# EasyEDA schematic SCH_steren_mot-300_water_pump_conmutation_circuit_2024-02-13.json

## Sheets
1 template_circuit: TITLE: Steren MOT-300 3v3 switching circuit; REV: 1.0; Date: 2024-02-13; Sheet: 1/1; Drawn By: Mortrack8; Company: Your Company
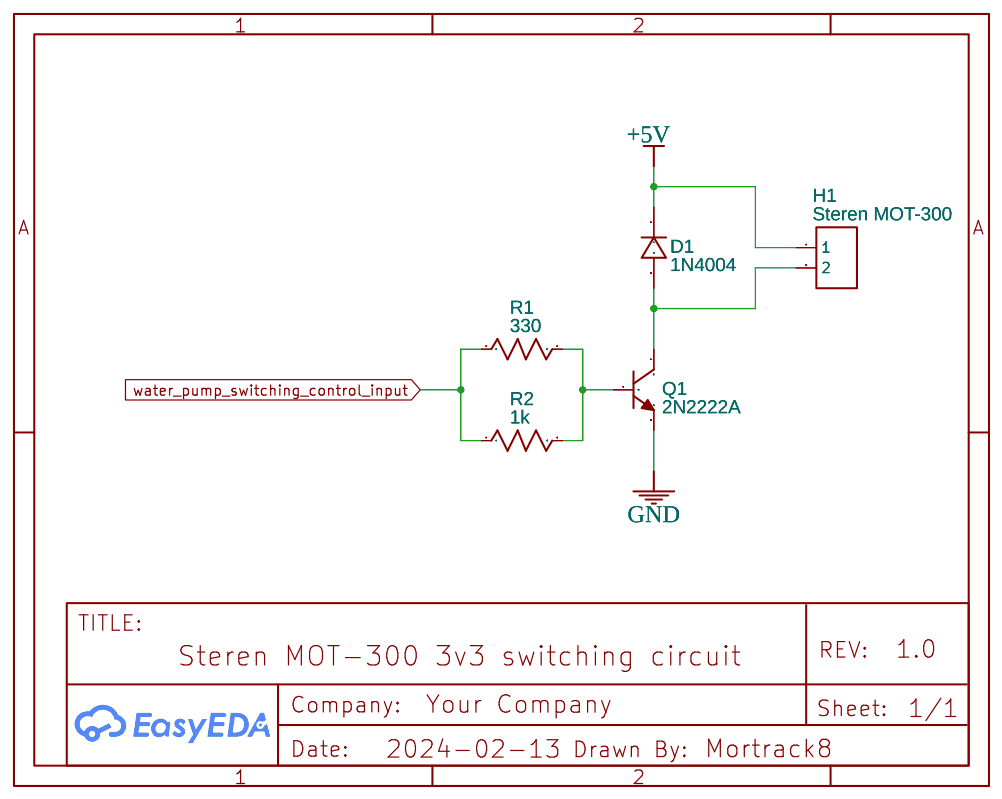
[diagram p0: template_circuit]
2 hot_water_pump_3v3_switching_circuit: TITLE: Hot Water Pump 3v3 switching circuit; Company: None
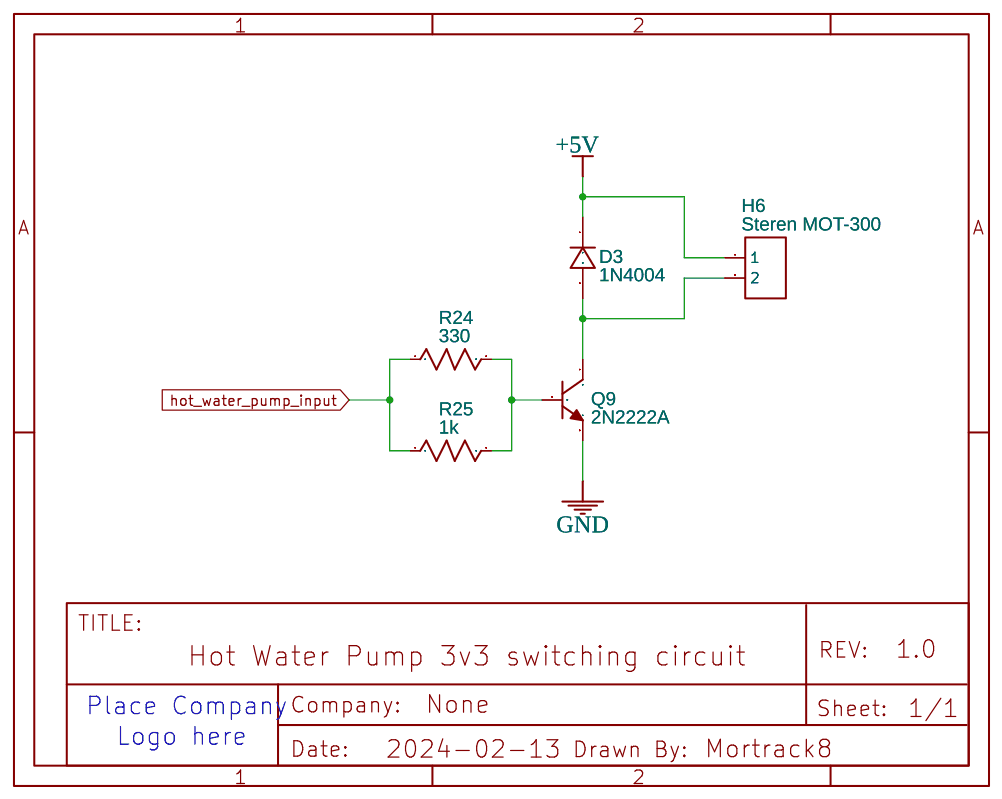
[diagram p1: hot_water_pump_3v3_switching_circuit]
3 cold_water_pump_3v3_switching_circuit: TITLE: Cold Water Pump 3v3 switching circuit; Company: None
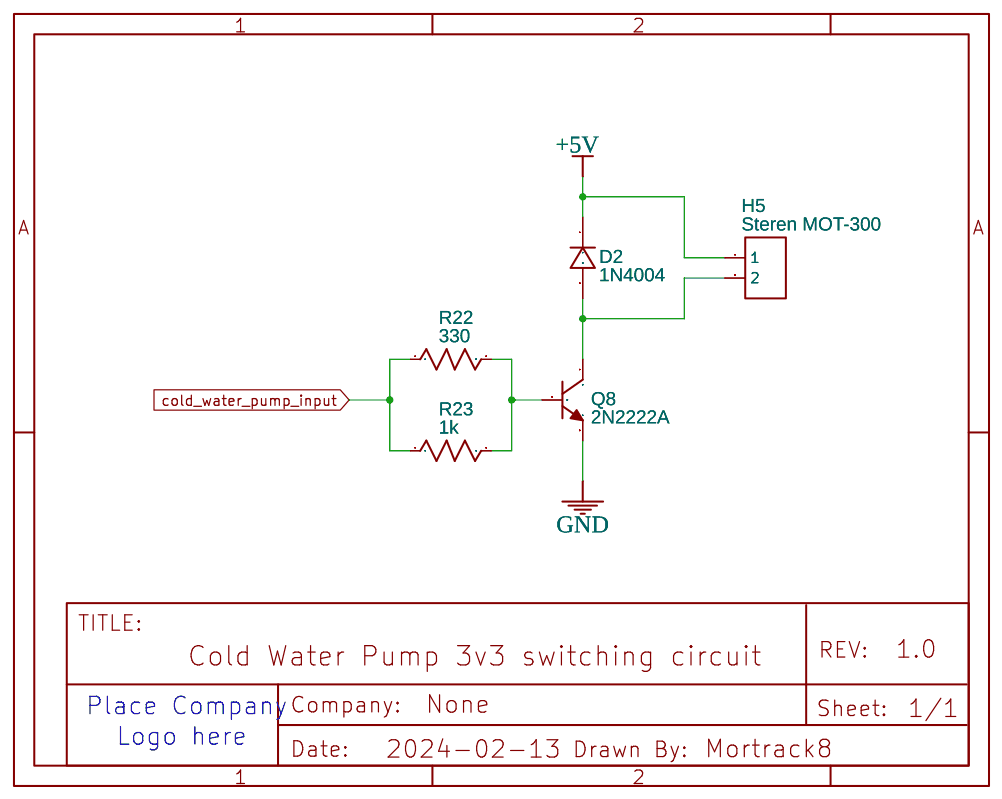
[diagram p2: cold_water_pump_3v3_switching_circuit]

## Parts
sheet cold_water_pump_3v3_switching_circuit
D2  1N4004  [DO-15_BD3.1-L6.7-P10.70-D0.9-RD]
H5  Steren MOT-300  [HDR-F-2.54_1X2]
Q8  2N2222A  [TO-92-3_L4.8-W3.7-P2.54-R]
R22  330  [R_AXIAL-0.5]
R23  1k  [R_AXIAL-0.5]
sheet hot_water_pump_3v3_switching_circuit
D3  1N4004  [DO-15_BD3.1-L6.7-P10.70-D0.9-RD]
H6  Steren MOT-300  [HDR-F-2.54_1X2]
Q9  2N2222A  [TO-92-3_L4.8-W3.7-P2.54-R]
R24  330  [R_AXIAL-0.5]
R25  1k  [R_AXIAL-0.5]
sheet template_circuit
D1  1N4004  [DO-15_BD3.1-L6.7-P10.70-D0.9-RD]
H1  Steren MOT-300  [HDR-F-2.54_1X2]
Q1  2N2222A  [TO-92-3_L4.8-W3.7-P2.54-R]
R1  330  [R_AXIAL-0.5]
R2  1k  [R_AXIAL-0.5]

## Library data of the parts
D1-D3 = 1N4004G: Contributor: LCSC; Supplier: LCSC; Supplier Part: C232435; Manufacturer: onsemi(安森美); JLCPCB Part Class: Extended Part
H1 H5 H6 = HDR-F-2.54_1x2: Supplier Part: C49661; Supplier: LCSC; Contributor: LCEDA_Lib
Q1 Q8 Q9 = 2N2222A: Contributor: LCSC; Supplier: LCSC; Supplier Part: C358533; Manufacturer: BLUE ROCKET(蓝箭); JLCPCB Part Class: Extended Part
R1 R2 R22-R25 = R_AXIAL-0.5_US: Contributor: LCEDA_Lib

## Nets
+5V: D1.1 D2.1 D3.1 H1.1 H5.1 H6.1
GND: Q1.3(E) Q8.3(E) Q9.3(E)
cold_water_pump_input: R22.1 R23.1
hot_water_pump_input: R24.1 R25.1
water_pump_switching_control_input: R1.1 R2.1
Net-(D1-2): D1.2 H1.2 Q1.1(C)
Net-(D2-2): D2.2 H5.2 Q8.1(C)
Net-(D3-2): D3.2 H6.2 Q9.1(C)
Net-(Q1-2): Q1.2(B) R1.2 R2.2
Net-(Q8-2): Q8.2(B) R22.2 R23.2
Net-(Q9-2): Q9.2(B) R24.2 R25.2

## Notes on the sheets
sheet 2
- Place Company
- Logo here
sheet 3
- Place Company
- Logo here
